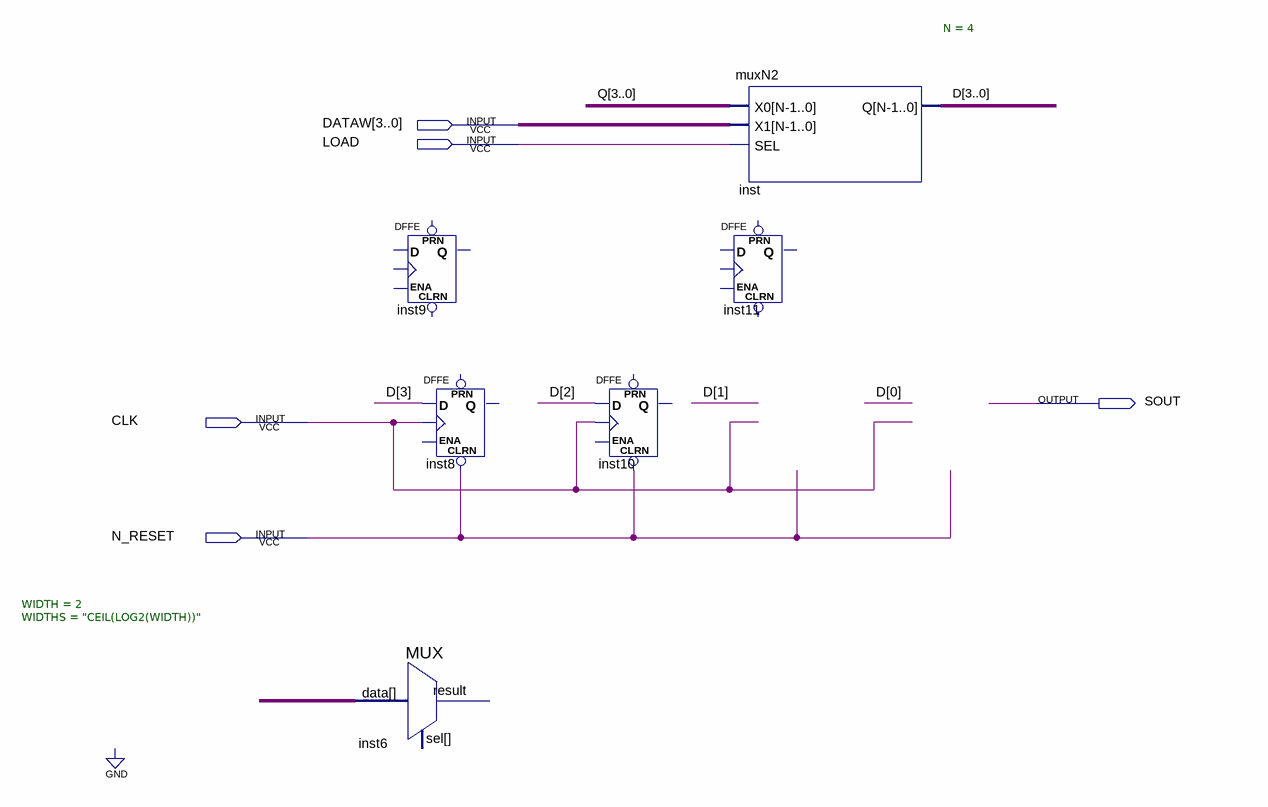
[diagram p0: schematic sheet]
// Quartus schematic p2s.bdf as structural Verilog: 6 symbols, 5 pins
module p2s (
  input  [3:0] DATAW,
  input  LOAD,
  input  CLK,
  input  N_RESET,
  output SOUT
);

  wire [1:0] undriven;
  wire [3:0] D, Q;

  MUX #(.WIDTH(2), .WIDTHS("CEIL(LOG2(WIDTH))")) inst6 (.data(undriven));  // open: sel, result
  DFFE inst9 ();  // open: PRN, CLRN, D, CLK, ENA, Q
  DFFE inst8 (.CLRN(N_RESET), .D(D[3]), .CLK(CLK));  // open: PRN, ENA, Q
  DFFE inst10 (.CLRN(N_RESET), .D(D[2]), .CLK(CLK));  // open: PRN, ENA, Q
  muxN2 #(.N(4)) inst (.X0(Q), .X1(DATAW), .SEL(LOAD), .Q(D));
  DFFE inst11 ();  // open: PRN, CLRN, D, CLK, ENA, Q
endmodule
